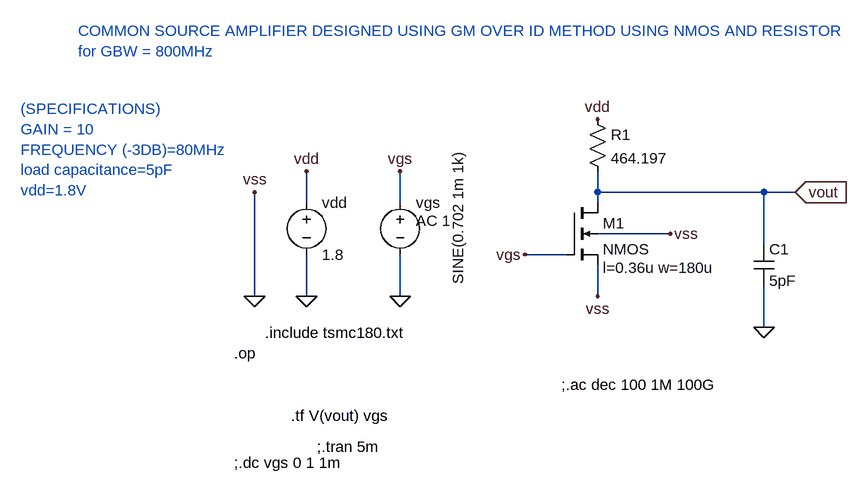
[diagram p0: schematic CSAmp_GBW800Mhz.asc]
CSAmp_GBW800Mhz.asc, the LTspice schematic file:
Version 4
SHEET 1 880 680
WIRE 320 112 320 80
WIRE 576 112 320 112
WIRE 624 112 576 112
WIRE -128 128 -128 80
WIRE 16 128 16 80
WIRE 320 128 320 112
WIRE 432 176 320 176
WIRE 576 192 576 112
WIRE 272 208 208 208
WIRE -208 272 -208 112
WIRE -128 272 -128 208
WIRE 16 272 16 208
WIRE 320 272 320 224
WIRE 576 320 576 256
FLAG 16 272 0
FLAG -128 272 0
FLAG -208 272 0
FLAG -208 112 vss
FLAG -128 80 vdd
FLAG 16 80 vgs
FLAG 320 272 vss
FLAG 432 176 vss
FLAG 208 208 vgs
FLAG 320 0 vdd
FLAG 624 112 vout
IOPIN 624 112 In
FLAG 576 320 0
SYMBOL nmos4 272 128 R0
WINDOW 123 56 100 Left 2
SYMATTR Value2 l=0.36u w=180u
SYMATTR InstName M1
SYMBOL voltage -128 112 R0
WINDOW 123 0 0 Left 0
WINDOW 39 0 0 Left 0
SYMATTR InstName vdd
SYMATTR Value 1.8
SYMBOL res 304 -16 R0
SYMATTR InstName R1
SYMATTR Value 464.197
SYMBOL cap 560 192 R0
SYMATTR InstName C1
SYMATTR Value 5pF
SYMBOL voltage 16 112 R0
WINDOW 123 24 44 Left 2
WINDOW 39 0 0 Left 0
WINDOW 3 89 -64 VRight 2
SYMATTR Value2 AC 1
SYMATTR Value SINE(0.702 1m 1k)
SYMATTR InstName vgs
TEXT -192 328 Left 2 !.include tsmc180.txt
TEXT -240 360 Left 2 !.op
TEXT -152 456 Left 2 !.tf V(vout) vgs
TEXT -112 504 Left 2 !;.tran 5m
TEXT -240 528 Left 2 !;.dc vgs 0 1 1m
TEXT -568 -16 Left 2 ;(SPECIFICATIONS)\nGAIN = 10\nFREQUENCY (-3DB)=80MHz\nload capacitance=5pF\nvdd=1.8V
TEXT -480 -136 Left 2 ;COMMON SOURCE AMPLIFIER DESIGNED USING GM OVER ID METHOD USING NMOS AND RESISTOR\nfor GBW = 800MHz
TEXT 264 408 Left 2 !;.ac dec 100 1M 100G

The netlist it stands for:
* CSAmp_GBW800Mhz.asc
M1 vout vgs 0 0 NMOS l=0.36u w=180u
vdd vdd 0 1.8
R1 vdd vout 464.197
C1 vout 0 5pF
vgs vgs 0 SINE(0.702 1m 1k) AC 1
.model NMOS NMOS
.model PMOS PMOS
.lib standard.mos
.include tsmc180.txt
.op
.tf V(vout) vgs
;.tran 5m
;.dc vgs 0 1 1m
* (SPECIFICATIONS)
* GAIN = 10
* FREQUENCY (-3DB)=80MHz
* load capacitance=5pF
* vdd=1.8V
* COMMON SOURCE AMPLIFIER DESIGNED USING GM OVER ID METHOD USING NMOS AND RESISTOR
* for GBW = 800MHz
;.ac dec 100 1M 100G
.backanno
.end